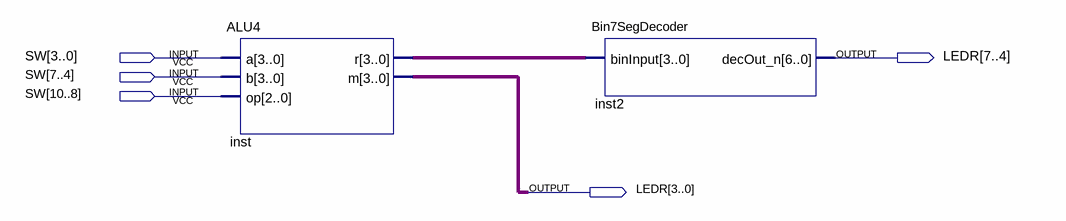
[diagram p0: schematic sheet]
// Quartus schematic ALU7Seg.bdf as structural Verilog: 2 symbols, 5 pins
module ALU7Seg (
  input  [10:0] SW,
  output [7:0] LEDR
);

  wire [3:0] inst_r;

  ALU4 inst (.a(SW[3:0]), .b(SW[7:4]), .op(SW[10:8]), .r(inst_r), .m(LEDR[3:0]));
  Bin7SegDecoder inst2 (.binInput(inst_r), .decOut_n(LEDR[7:4]));
endmodule
